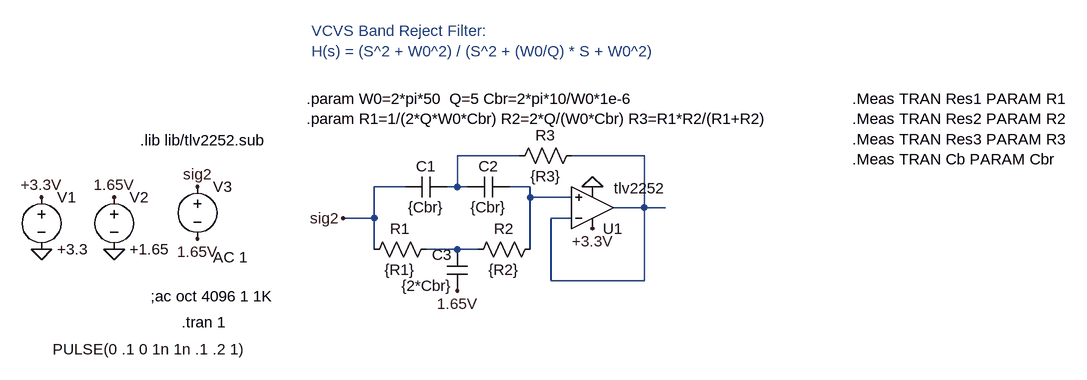
[diagram p0: schematic band-reject.asc]
band-reject.asc, the LTspice schematic file:
Version 4
SHEET 1 1232 680
WIRE 272 16 176 16
WIRE 464 16 352 16
WIRE 96 64 48 64
WIRE 176 64 176 16
WIRE 176 64 160 64
WIRE 192 64 176 64
WIRE 288 64 256 64
WIRE 288 80 288 64
WIRE 352 80 288 80
WIRE 464 96 464 16
WIRE 464 96 416 96
WIRE 496 96 464 96
WIRE 48 112 48 64
WIRE 48 112 0 112
WIRE 352 112 320 112
WIRE 48 160 48 112
WIRE 176 160 128 160
WIRE 208 160 176 160
WIRE 288 160 288 80
WIRE 320 208 320 112
WIRE 464 208 464 96
WIRE 464 208 320 208
FLAG -352 160 0
FLAG -464 160 0
FLAG -464 80 +3.3V
FLAG -352 80 1.65V
FLAG 384 64 0
FLAG 384 128 +3.3V
FLAG 176 224 1.65V
FLAG -224 64 sig2
FLAG -224 144 1.65V
FLAG 0 112 sig2
SYMBOL cap 160 48 R90
WINDOW 0 0 32 VBottom 2
WINDOW 3 32 32 VTop 2
SYMATTR InstName C1
SYMATTR Value {Cbr}
SYMBOL cap 256 48 R90
WINDOW 0 0 32 VBottom 2
WINDOW 3 32 32 VTop 2
SYMATTR InstName C2
SYMATTR Value {Cbr}
SYMBOL cap 192 224 R180
WINDOW 0 24 56 Left 2
WINDOW 3 24 8 Left 2
SYMATTR InstName C3
SYMATTR Value {2*Cbr}
SYMBOL res 144 144 R90
WINDOW 0 0 56 VBottom 2
WINDOW 3 32 56 VTop 2
SYMATTR InstName R1
SYMATTR Value {R1}
SYMBOL res 304 144 R90
WINDOW 0 0 56 VBottom 2
WINDOW 3 32 56 VTop 2
SYMATTR InstName R2
SYMATTR Value {R2}
SYMBOL voltage -464 64 R0
WINDOW 123 0 0 Left 2
WINDOW 39 0 0 Left 2
SYMATTR InstName V1
SYMATTR Value +3.3
SYMBOL voltage -352 64 R0
WINDOW 123 0 0 Left 2
WINDOW 39 0 0 Left 2
SYMATTR InstName V2
SYMATTR Value +1.65
SYMBOL Opamps\\opamp2 384 160 M180
WINDOW 3 33 94 Left 2
SYMATTR Value tlv2252
SYMATTR InstName U1
SYMBOL res 368 0 R90
WINDOW 0 0 56 VBottom 2
WINDOW 3 32 56 VTop 2
SYMATTR InstName R3
SYMATTR Value {R3}
SYMBOL voltage -224 48 R0
WINDOW 123 24 124 Left 2
WINDOW 39 0 0 Left 2
WINDOW 3 -223 266 Left 2
SYMATTR Value2 AC 1
SYMATTR InstName V3
SYMATTR Value PULSE(0 .1 0 1n 1n .1 .2 1)
TEXT -312 -8 Left 2 !.lib lib/tlv2252.sub
TEXT -56 -72 Left 2 !.param W0=2*pi*50  Q=5 Cbr=2*pi*10/W0*1e-6\n.param R1=1/(2*Q*W0*Cbr) R2=2*Q/(W0*Cbr) R3=R1*R2/(R1+R2)
TEXT -296 232 Left 2 !;ac oct 4096 1 1K
TEXT 784 -72 Left 2 !.Meas TRAN Res1 PARAM R1\n.Meas TRAN Res2 PARAM R2\n.Meas TRAN Res3 PARAM R3\n.Meas TRAN Cb PARAM Cbr
TEXT -48 -176 Left 2 ;VCVS Band Reject Filter:\nH(s) = (S^2 + W0^2) / (S^2 + (W0/Q) * S + W0^2)
TEXT -248 272 Left 2 !.tran 1

The netlist it stands for:
* band-reject.asc
C1 N001 sig2 {Cbr}
C2 N003 N001 {Cbr}
C3 1.65V N004 {2*Cbr}
R1 N004 sig2 {R1}
R2 N003 N004 {R2}
V1 +3.3V 0 +3.3
V2 1.65V 0 +1.65
XU1 N003 N002 +3.3V 0 N002 tlv2252  ; pins In+ In- V+ V- OUT
R3 N002 N001 {R3}
V3 sig2 1.65V PULSE(0 .1 0 1n 1n .1 .2 1) AC 1
.lib lib/tlv2252.sub
.param W0=2*pi*50  Q=5 Cbr=2*pi*10/W0*1e-6
.param R1=1/(2*Q*W0*Cbr) R2=2*Q/(W0*Cbr) R3=R1*R2/(R1+R2)
;ac oct 4096 1 1K
.Meas TRAN Res1 PARAM R1
.Meas TRAN Res2 PARAM R2
.Meas TRAN Res3 PARAM R3
.Meas TRAN Cb PARAM Cbr
* VCVS Band Reject Filter:
* H(s) = (S^2 + W0^2) / (S^2 + (W0/Q) * S + W0^2)
.tran 1
.backanno
.end